# Altium schematic sheet base.SchDoc
size A4; SheetNumber: 6; SheetTotal: 6
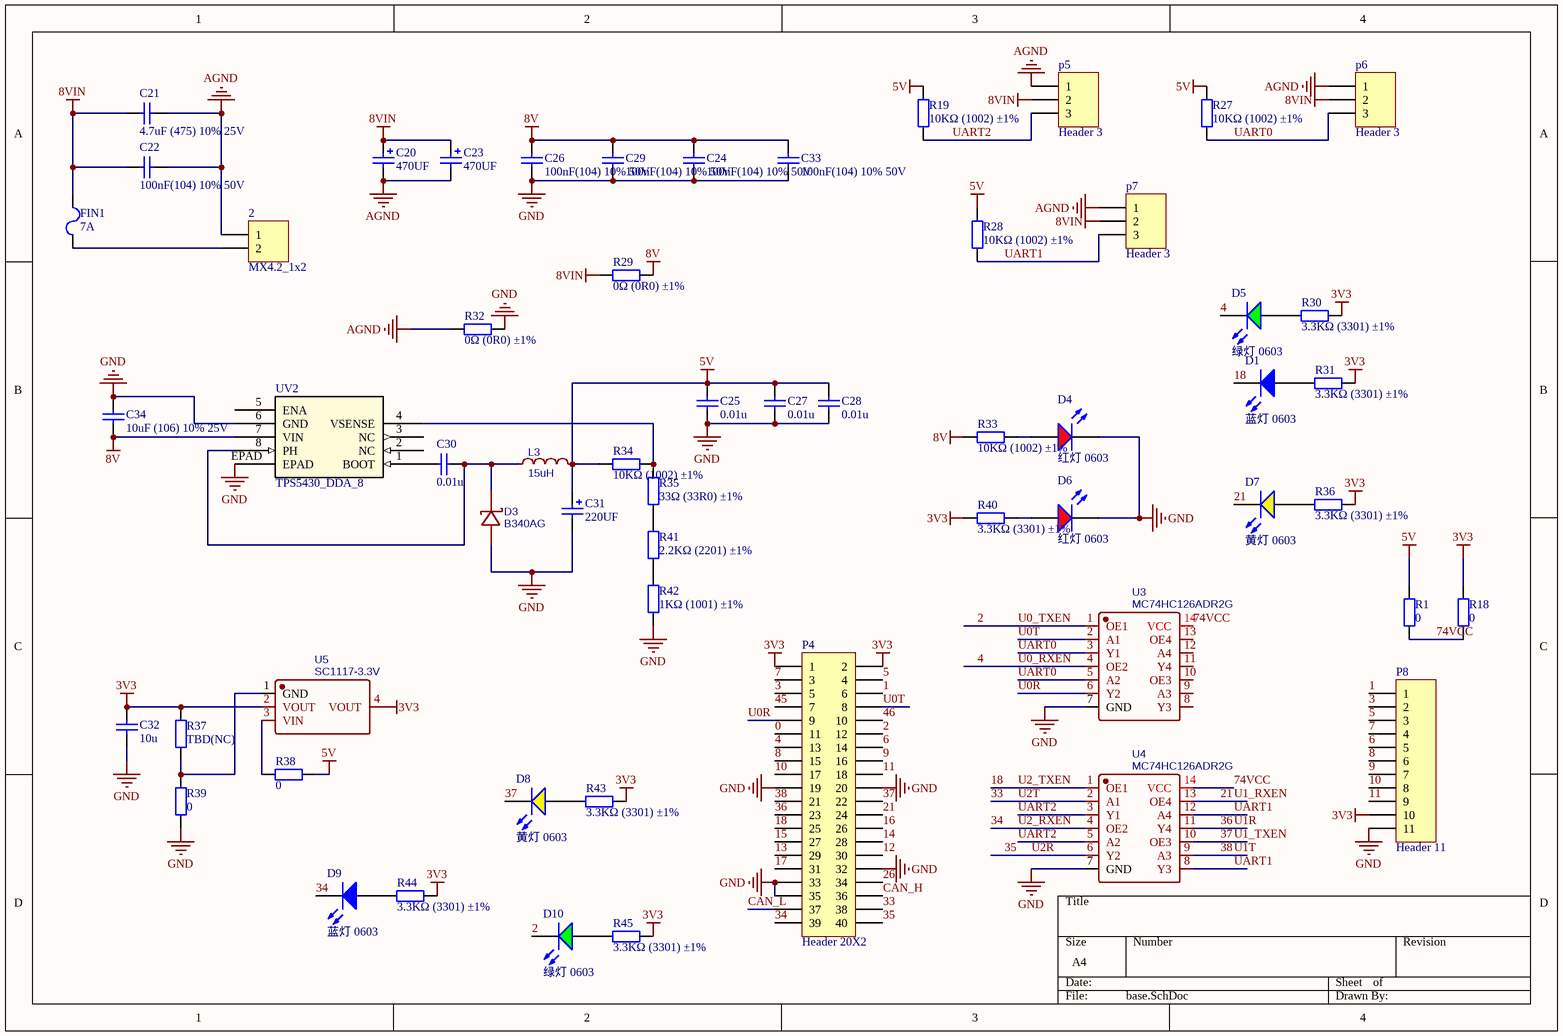
[diagram p0: base.SchDoc]

## Parts
2  MX4.2_1x2  [MX4.2_1x2]
C20  470UF  [CAP-SMD_BD8.0-L8.3-W8.3-LS9.0-FD]
C21  4.7uF (475) 10% 25V  [LC-0805_C]
C22  100nF(104) 10% 50V  [LC-0805_C]
C23  470UF  [CAP-SMD_BD8.0-L8.3-W8.3-LS9.0-FD]
C24  100nF(104) 10% 50V  [LC-0805_C]
C25  0.01u  [C0603]
C26  100nF(104) 10% 50V  [LC-0805_C]
C27  0.01u  [C0603]
C28  0.01u  [C0603]
C29  100nF(104) 10% 50V  [LC-0805_C]
C30  0.01u  [C0603]
C31  220UF  [SMD,6.3x7.7mm]
C32  10u  [C0603]
C33  100nF(104) 10% 50V  [LC-0805_C]
C34  10uF (106) 10% 25V  [LC-0805_C]
D1  蓝灯 0603  [LC-0603_LED_S1]
D3  B340AG  [SMA_L4.4-W2.6-LS5.0-RD]
D4  红灯 0603  [LC-0603_LED_S1]
D5  绿灯 0603  [LC-0603_LED_S1]
D6  红灯 0603  [LC-0603_LED_S1]
D7  黄灯 0603  [LC-0603_LED_S1]
D8  黄灯 0603  [LC-0603_LED_S1]
D9  蓝灯 0603  [LC-0603_LED_S1]
D10  绿灯 0603  [LC-0603_LED_S1]
FIN1  7A  [2512]
L3  15uH  [电感]
P4  Header 20X2  [ESP-BORD]
p5  Header 3  [PH2.0-LI-3P]
p6  Header 3  [PH2.0-LI-3P]
p7  Header 3  [PH2.0-LI-3P]
P8  Header 11  [HDR1X11]
R1  0  [R0603]
R18  0  [R0603]
R19  10KΩ (1002) ±1%  [LC-0402_R]
R27  10KΩ (1002) ±1%  [LC-0402_R]
R28  10KΩ (1002) ±1%  [LC-0402_R]
R29  0Ω (0R0) ±1%  [LC-0805_R]
R30  3.3KΩ (3301) ±1%  [LC-0402_R]
R31  3.3KΩ (3301) ±1%  [LC-0402_R]
R32  0Ω (0R0) ±1%  [LC-0805_R]
R33  10KΩ (1002) ±1%  [LC-0402_R]
R34  10KΩ (1002) ±1%  [LC-0805_R]
R35  33Ω (33R0) ±1%  [LC-0805_R]
R36  3.3KΩ (3301) ±1%  [LC-0402_R]
R37  TBD(NC)  [R0603]
R38  0  [R0603]
R39  0  [R0603]
R40  3.3KΩ (3301) ±1%  [LC-0402_R]
R41  2.2KΩ (2201) ±1%  [LC-0805_R]
R42  1KΩ (1001) ±1%  [LC-0805_R]
R43  3.3KΩ (3301) ±1%  [LC-0402_R]
R44  3.3KΩ (3301) ±1%  [LC-0402_R]
R45  3.3KΩ (3301) ±1%  [LC-0402_R]
U3  MC74HC126ADR2G  [SOIC-14_L8.7-W3.9-P1.27-LS6.0-BL]
U4  MC74HC126ADR2G  [SOIC-14_L8.7-W3.9-P1.27-LS6.0-BL]
U5  SC1117-3.3V  [SOT-223_L6.5-W3.5-P2.30-LS7.0-BR]
UV2  TPS5430_DDA_8  [DDA8_3P1X2P4]

## Nets
3V3: C32.2 P4.1 P4.2 P8.10 R18.2 R30.2 R31.2 R36.2 R37.1 R40.1 R43.2 R44.2 R45.2 U5.2(VOUT) U5.4(VOUT)
5V: C25.1 C27.1 C28.2 C31.1 L3.2 R1.2 R19.1 R27.2 R28.2 R34.1 R38.1
8V: C24.2 C26.2 C29.2 C33.2 C34.1 R29.2 R33.1 UV2.7(VIN)
8VIN: C20.1 C21.1 C22.1 C23.1 FIN1.2 p5.2 p6.2 p7.2 R29.1
AGND: 2.1 C20.2 C21.2 C22.2 C23.2 p5.1 p6.1 p7.1 R32.1
GND: C24.1 C25.2 C26.1 C27.2 C28.1 C29.1 C31.2 C32.1 C33.1 C34.2 D3.2(A) D4.K D6.K P4.19 P4.20 P4.32 P4.33 P4.35 P8.11 R32.2 R39.1 R42.1 U3.7(GND) U4.7(GND) UV2.6(GND) UV2.EPAD
0: P4.11
1: P4.6 P8.1
2: D10.K P4.12 U3.1(OE1)  [also labelled U0_TXEN]
3: P4.5 P8.2
4: D5.K P4.13 U3.4(OE2)  [also labelled U0_RXEN]
5: P4.4 P8.3
6: P4.14 P8.5
7: P4.3 P8.4
8: P4.15 P8.6
9: P4.16 P8.7
10: P4.17 P8.8
11: P4.18 P8.9
12: P4.30
13: P4.29
14: P4.28
15: P4.27
16: P4.26
17: P4.31
18: D1.K P4.25 U4.1(OE1)  [also labelled U2_TXEN]
21: D7.K P4.24 U4.13(OE4)  [also labelled U1_RXEN]
26: P4.34
33: P4.38 U4.2(A1)  [also labelled U2T]
34: D9.K P4.39 U4.4(OE2)  [also labelled U2_RXEN]
35: P4.40 U4.6(Y2)  [also labelled U2R]
36: P4.23 U4.11(Y4)  [also labelled U1R]
37: D8.K P4.22 U4.10(OE3)  [also labelled U1_TXEN]
38: P4.21 U4.9(A3)  [also labelled U1T]
45: P4.7
46: P4.10
74VCC: R1.1 R18.1 U3.14(VCC) U4.14(VCC)
CAN_H: P4.36
CAN_L: P4.37
U0R: P4.9 U3.6(Y2)
U0T: P4.8 U3.2(A1)
UART0: p6.3 R27.1 U3.3(Y1) U3.5(A2)
UART1: p7.3 R28.1 U4.8(Y3) U4.12(A4)
UART2: p5.3 R19.2 U4.3(Y1) U4.5(A2)
Net2_2: 2.2 FIN1.1
NetC30_1: C30.1 UV2.1(BOOT)
NetC30_2: C30.2 D3.1(C) L3.1 UV2.8(PH)
NetD1_A: D1.A R31.1
NetD4_A: D4.A R33.2
NetD5_A: D5.A R30.1
NetD6_A: D6.A R40.2
NetD7_A: D7.A R36.1
NetD8_A: D8.A R43.1
NetD9_A: D9.A R44.1
NetD10_A: D10.A R45.1
NetR34_2: R34.2 R35.2 UV2.4(VSENSE)
NetR35_1: R35.1 R41.2
NetR37_2: R37.2 R39.2 U5.1(GND)
NetR38_2: R38.2 U5.3(VIN)
NetR41_1: R41.1 R42.2

Not connected (* = marked no-connect by the designer): U3 8(Y3) 9(A3) 10(OE3) 11(Y4) 12(A4) 13(OE4); UV2 2(NC) 3(NC) 5(ENA)

## Library data of the parts
C20 C23 C31 = C_RB-470UF/25V_5X10
C21 = 0805 4.7uF (475) 10% 25V: 贴片电容; ComponentLink1Description: 供应商链接; ComponentLink1URL: http://www.szlcsc.com/product/details_2131.html; Package: 0805; Supplier: LC; SuppliersPartNumber: C1779
C22 C24 C26 C29 C33 = 0805 100nF(104) 10% 50V: 贴片电容; ComponentLink1Description: 供应商链接; ComponentLink1URL: http://www.szlcsc.com/product/details_50686.html; Package: 0805; Supplier: LC; SuppliersPartNumber: C49678
C25 C27 C28 C30 C32 = CAP_0805
C34 = 0805 10uF (106) 10% 25V: 贴片电容; ComponentLink1Description: 供应商链接; ComponentLink1URL: http://www.szlcsc.com/product/details_16532.html; Package: 0805; Supplier: LC; SuppliersPartNumber: C15850
D1 D9 = 0603 蓝灯: 发光二极管; ComponentLink1Description: 供应商链接; ComponentLink1URL: http://www.szlcsc.com/product/details_73150.html; Package: 0603; Supplier: LC; SuppliersPartNumber: C72041
D3 = B340AG: BOM_Manufacturer: Shikues; Contributor: LCSC; BOM_Supplier: LCSC; BOM_Supplier Part: C433997; BOM_Manufacturer Part: B340AG; BOM_JLCPCB Part Class: Extended Part; spicePre: D; spiceSymbolName: B340AG
D4 D6 = 0603 红灯: 发光二极管; ComponentLink1Description: 供应商链接; ComponentLink1URL: http://www.szlcsc.com/product/details_2659.html; Package: 0603; Supplier: LC; SuppliersPartNumber: C2286
D5 D10 = 0603 绿灯: 发光二极管; ComponentLink1Description: 供应商链接; ComponentLink1URL: http://www.szlcsc.com/product/details_73152.html; Package: 0603; Supplier: LC; SuppliersPartNumber: C72043
D7 D8 = 0603 黄灯: 发光二极管; ComponentLink1Description: 供应商链接; ComponentLink1URL: http://www.szlcsc.com/product/details_73147.html; Package: 0603; Supplier: LC; SuppliersPartNumber: C72038
FIN1 = Fuse
L3 = 15uH: BOM_Manufacturer: CENKER; BOM_Manufacturer Part: CKCS3012-15uH/M; nameAlias: Inductance; Contributor: LCSC; BOM_Supplier: LCSC; BOM_Supplier Part: C354559; BOM_JLCPCB Part Class: Extended Part; spicePre: L; spiceSymbolName: CKCS3012-15UH/M
P4 = Header 20X2: Header, 20-Pin, Dual row; LatestRevisionDate: 17-Jul-2002; LatestRevisionNote: Re-released for DXP Platform.; Publisher: Altium Limited
p5-p7 = Header 3: Header, 3-Pin; LatestRevisionDate: 17-Jul-2002; LatestRevisionNote: Re-released for DXP Platform.; Publisher: Altium Limited
P8 = Header 11: Header, 11-Pin; LatestRevisionDate: 17-Jul-2002; LatestRevisionNote: Re-released for DXP Platform.; Publisher: Altium Limited
R1 R18 R37-R39 = RES_0805
R19 R27 R28 R33 = 0402 10KΩ (1002) 1%: 贴片电阻; ComponentLink1Description: 供应商链接; ComponentLink1URL: http://www.szlcsc.com/product/details_26487.html; Package: 0402; Supplier: LC; SuppliersPartNumber: C25744
R29 R32 = 0805 0Ω (0R0) 1%: 贴片电阻; ComponentLink1Description: 供应商链接; ComponentLink1URL: http://www.szlcsc.com/product/details_18165.html; Package: 0805; Supplier: LC; SuppliersPartNumber: C17477
R30 R31 R36 R40 R43-R45 = 0402 3.3KΩ (3301) 1%: 贴片电阻; ComponentLink1Description: 供应商链接; ComponentLink1URL: http://www.szlcsc.com/product/details_26633.html; Package: 0402; Supplier: LC; SuppliersPartNumber: C25890
R34 = 0805 10KΩ (1002) 1%: 贴片电阻; ComponentLink1Description: 供应商链接; ComponentLink1URL: http://www.szlcsc.com/product/details_18102.html; Package: 0805; Supplier: LC; SuppliersPartNumber: C17414
R35 = 0805 33Ω (33R0) 1%: 贴片电阻; ComponentLink1Description: 供应商链接; ComponentLink1URL: http://www.szlcsc.com/product/details_18322.html; Package: 0805; Supplier: LC; SuppliersPartNumber: C17634
R41 = 0805 2.2KΩ (2201) 1%: 贴片电阻; ComponentLink1Description: 供应商链接; ComponentLink1URL: http://www.szlcsc.com/product/details_18208.html; Package: 0805; Supplier: LC; SuppliersPartNumber: C17520
R42 = 0805 1KΩ (1001) 1%: 贴片电阻; ComponentLink1Description: 供应商链接; ComponentLink1URL: http://www.szlcsc.com/product/details_18201.html; Package: 0805; Supplier: LC; SuppliersPartNumber: C17513
U3 U4 = MC74HC126ADR2G: BOM_Manufacturer: ON Semicon; Contributor: LCSC; BOM_Supplier: LCSC; BOM_Supplier Part: C233530; BOM_Manufacturer Part: MC74HC126ADR2G; BOM_JLCPCB Part Class: Extended Part; spicePre: U; spiceSymbolName: MC74HC126ADR2G
U5 = SC1117-3.3V: BOM_Manufacturer: FM; Contributor: LCSC; BOM_Supplier: LCSC; BOM_Manufacturer Part: SC1117-3.3V; BOM_Supplier Part: C173386; BOM_JLCPCB Part Class: Extended Part; spicePre: U; spiceSymbolName: SC1117-3.3V
UV2 = TPS5430_DDA_8: Imported; Vendor: Texas Instruments; PACKAGE_DESIGNATOR: DDA; PIN_COUNT: 8; FAMILY_NAME: STEP-DOWN REGULATOR; INDUSTRY_STD_PKG_TYPE: SO PowerPAD; Manufacturer_Part_Number: tps5430_dda_8; GENERIC_PART_NUMBER: TPS5430; Manufacturer: Texas Instruments; Datasheet_URL: http://www.ti.com/lit/gpn/TPS5430; Value: Value; Type: Type; RefDes: RefDes